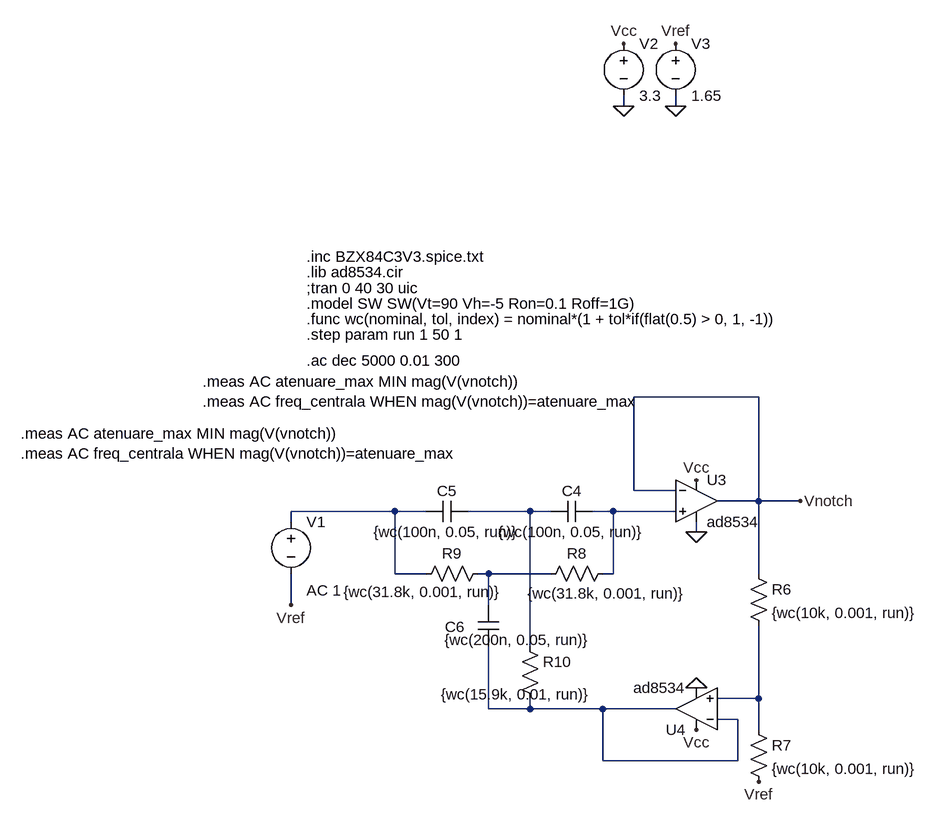
[diagram p0: schematic Toleranta NOTCH.asc]
Toleranta NOTCH.asc, the LTspice schematic file:
Version 4.1
SHEET 1 880 1280
WIRE 144 -144 144 -160
WIRE 224 -144 224 -160
WIRE 352 304 160 304
WIRE 160 448 160 304
WIRE 224 448 160 448
WIRE 352 464 352 304
WIRE 352 464 288 464
WIRE 416 464 352 464
WIRE -208 480 -368 480
WIRE -160 480 -208 480
WIRE 0 480 -96 480
WIRE 32 480 0 480
WIRE 128 480 96 480
WIRE 224 480 128 480
WIRE -368 496 -368 480
WIRE 256 512 256 496
WIRE -208 576 -208 480
WIRE -160 576 -208 576
WIRE -64 576 -80 576
WIRE 32 576 -64 576
WIRE 128 576 128 480
WIRE 128 576 112 576
WIRE 352 576 352 464
WIRE -368 624 -368 576
WIRE -64 624 -64 576
WIRE 0 688 0 480
WIRE 352 768 352 656
WIRE 352 768 288 768
WIRE -64 784 -64 688
WIRE 0 784 0 768
WIRE 0 784 -64 784
WIRE 112 784 0 784
WIRE 224 784 112 784
WIRE 320 800 288 800
WIRE 352 816 352 768
WIRE 112 864 112 784
WIRE 320 864 320 800
WIRE 320 864 112 864
FLAG 224 -144 0
FLAG 144 -144 0
FLAG 224 -240 Vref
FLAG 144 -240 Vcc
FLAG 256 512 0
FLAG 256 432 Vcc
FLAG 416 464 Vnotch
FLAG 352 896 Vref
FLAG 256 816 Vcc
FLAG 256 752 0
FLAG -368 624 Vref
SYMBOL voltage 144 -256 R0
SYMATTR InstName V2
SYMATTR Value 3.3
SYMBOL voltage 224 -256 R0
SYMATTR InstName V3
SYMATTR Value 1.65
SYMBOL OpAmps\\opamp2 256 400 R0
SYMATTR InstName U3
SYMATTR Value ad8534
SYMBOL res 336 560 R0
SYMATTR InstName R6
SYMATTR Value {wc(10k, 0.001, run)}
SYMBOL res 336 800 R0
SYMATTR InstName R7
SYMATTR Value {wc(10k, 0.001, run)}
SYMBOL cap 96 464 R90
WINDOW 0 0 32 VBottom 2
WINDOW 3 32 32 VTop 2
SYMATTR InstName C4
SYMATTR Value {wc(100n, 0.05, run)}
SYMBOL cap -96 464 R90
WINDOW 0 0 32 VBottom 2
WINDOW 3 32 32 VTop 2
SYMATTR InstName C5
SYMATTR Value {wc(100n, 0.05, run)}
SYMBOL res 128 560 R90
WINDOW 0 0 56 VBottom 2
WINDOW 3 31 10 VTop 2
SYMATTR InstName R8
SYMATTR Value {wc(31.8k, 0.001, run)}
SYMBOL res -64 560 R90
WINDOW 0 0 56 VBottom 2
WINDOW 3 28 101 VTop 2
SYMATTR InstName R9
SYMATTR Value {wc(31.8k, 0.001, run)}
SYMBOL cap -80 624 R0
WINDOW 0 -51 34 Left 2
WINDOW 3 -52 54 Left 2
SYMATTR InstName C6
SYMATTR Value {wc(200n, 0.05, run)}
SYMBOL res -16 672 R0
WINDOW 3 -121 90 Left 2
SYMATTR Value {wc(15.9k, 0.01, run)}
SYMATTR InstName R10
SYMBOL OpAmps\\opamp2 256 848 R180
SYMATTR InstName U4
SYMATTR Value ad8534
SYMBOL voltage -368 480 R0
WINDOW 123 24 122 Left 2
WINDOW 39 0 0 Left 0
SYMATTR Value2 AC 1
SYMATTR InstName V1
SYMATTR Value ""
TEXT -344 112 Left 2 !.lib ad8534.cir
TEXT -344 136 Left 2 !;tran 0 40 30 uic
TEXT -344 160 Left 2 !.model SW SW(Vt=90 Vh=-5 Ron=0.1 Roff=1G)
TEXT -344 88 Left 2 !.inc BZX84C3V3.spice.txt
TEXT -344 184 Left 2 !.func wc(nominal, tol, index) = nominal*(1 + tol*if(flat(0.5) > 0, 1, -1))
TEXT -344 208 Left 2 !.step param run 1 50 1\n
<<<<<<< HEAD
TEXT -784 360 Left 2 !.meas AC atenuare_max MIN mag(V(vnotch))\n.meas AC freq_centrala WHEN mag(V(vnotch))=atenuare_max
=======
TEXT -504 280 Left 2 !.meas AC atenuare_max MIN mag(V(vnotch))\n.meas AC freq_centrala WHEN mag(V(vnotch))=atenuare_max
>>>>>>> 5e186706979e8c8f13ca0721319277697f33904e
TEXT -344 248 Left 2 !.ac dec 5000 0.01 300

The netlist it stands for:
* Toleranta NOTCH.asc
V2 Vcc 0 3.3
V3 Vref 0 1.65
X§U3 N003 Vnotch Vcc 0 Vnotch ad8534  ; pins In+ In- V+ V- OUT
R6 Vnotch N005 {wc(10k, 0.001, run)}
R7 N005 Vref {wc(10k, 0.001, run)}
C4 N003 N002 {wc(100n, 0.05, run)}
C5 N002 N001 {wc(100n, 0.05, run)}
R8 N003 N004 {wc(31.8k, 0.001, run)}
R9 N004 N001 {wc(31.8k, 0.001, run)}
C6 N004 N006 {wc(200n, 0.05, run)}
R10 N002 N006 {wc(15.9k, 0.01, run)}
X§U4 N005 N006 Vcc 0 N006 ad8534  ; pins In+ In- V+ V- OUT
V1 N001 Vref AC 1
.lib ad8534.cir
;tran 0 40 30 uic
.model SW SW(Vt=90 Vh=-5 Ron=0.1 Roff=1G)
.inc BZX84C3V3.spice.txt
.func wc(nominal, tol, index) = nominal*(1 + tol*if(flat(0.5) > 0, 1, -1))
.step param run 1 50 1
.meas AC atenuare_max MIN mag(V(vnotch))
.meas AC freq_centrala WHEN mag(V(vnotch))=atenuare_max
.meas AC atenuare_max MIN mag(V(vnotch))
.meas AC freq_centrala WHEN mag(V(vnotch))=atenuare_max
.ac dec 5000 0.01 300
.backanno
.end